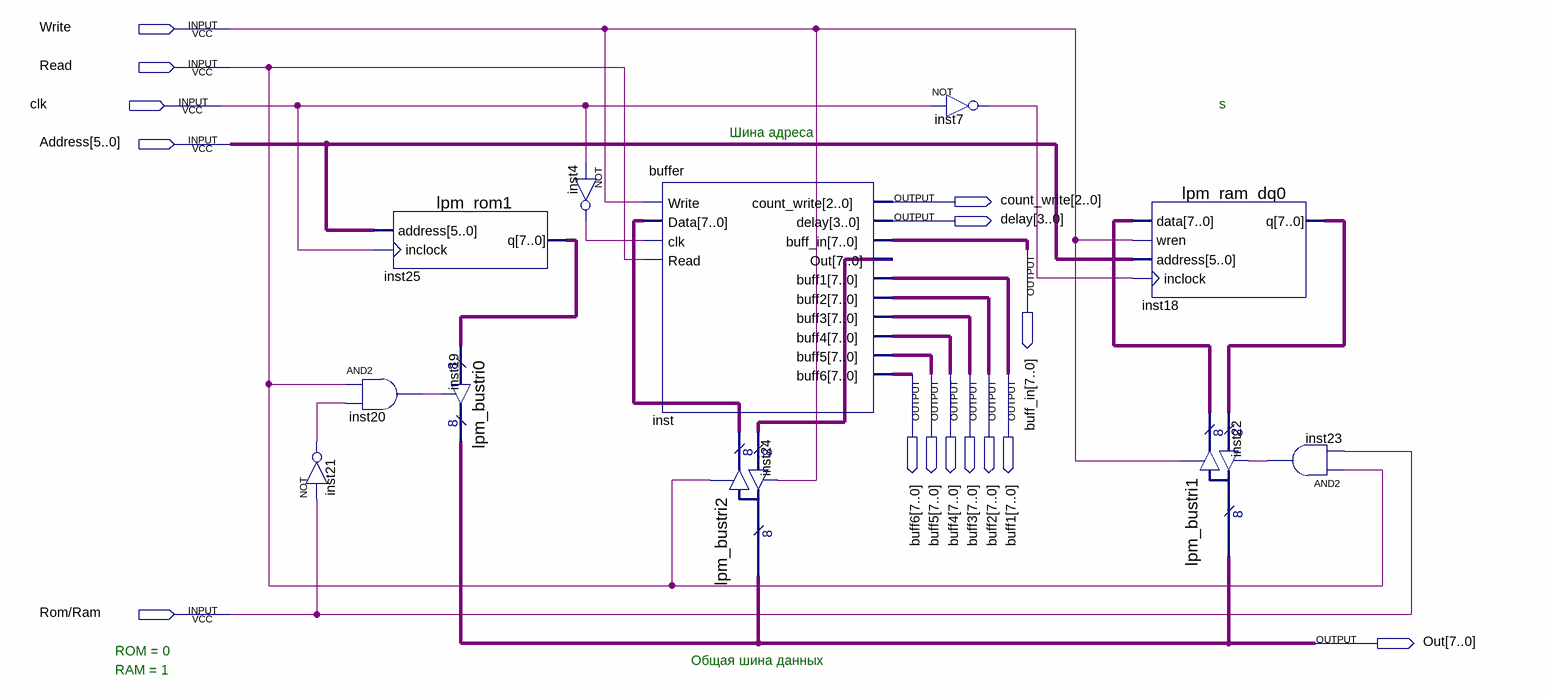
[diagram p0: schematic sheet]
// Quartus schematic Rom_Ram.bdf as structural Verilog: 11 symbols, 15 pins
module Rom_Ram (
  input  Write,
  input  Read,
  input  clk,
  input  [5:0] Address,
  input  \Rom/Ram ,
  output [2:0] count_write,
  output [3:0] delay,
  output [7:0] buff_in,
  output [7:0] buff6,
  output [7:0] buff5,
  output [7:0] buff4,
  output [7:0] buff3,
  output [7:0] buff2,
  output [7:0] buff1,
  output [7:0] Out
);

  wire inst4_out, inst7_out, inst20_out, inst21_out, inst23_out;
  wire [7:0] inst18_q, inst22_result, inst24_result, inst25_q, inst_out;

  not inst21 (inst21_out, \Rom/Ram );
  lpm_rom1 inst25 (.address(Address), .inclock(clk), .q(inst25_q));
  and inst20 (inst20_out, Read, inst21_out);
  lpm_bustri0 inst19 (.enabledt(inst20_out), .data(inst25_q), .tridata(Out));
  not inst4 (inst4_out, clk);
  buffer inst (
    .Write(Write), .Data(inst24_result), .clk(inst4_out), .Read(Read), .count_write(count_write),
    .delay(delay), .buff_in(buff_in), .Out(inst_out), .buff1(buff1), .buff2(buff2), .buff3(buff3),
    .buff4(buff4), .buff5(buff5), .buff6(buff6));
  lpm_bustri2 inst24 (.enabledt(Write), .data(inst_out), .enabletr(Read), .result(inst24_result), .tridata(Out));
  not inst7 (inst7_out, clk);
  lpm_ram_dq0 inst18 (.data(inst22_result), .wren(Write), .address(Address), .inclock(inst7_out), .q(inst18_q));
  lpm_bustri1 inst22 (.enabledt(inst23_out), .data(inst18_q), .enabletr(Write), .result(inst22_result), .tridata(Out));
  and inst23 (inst23_out, Read, \Rom/Ram );

  // Notes on the sheet:
  //   s
  //   Шина адреса
  //   ROM = 0
  //   Общая шина данных
  //   RAM = 1
endmodule
